# Altium project IMUVr3.PrjPcb
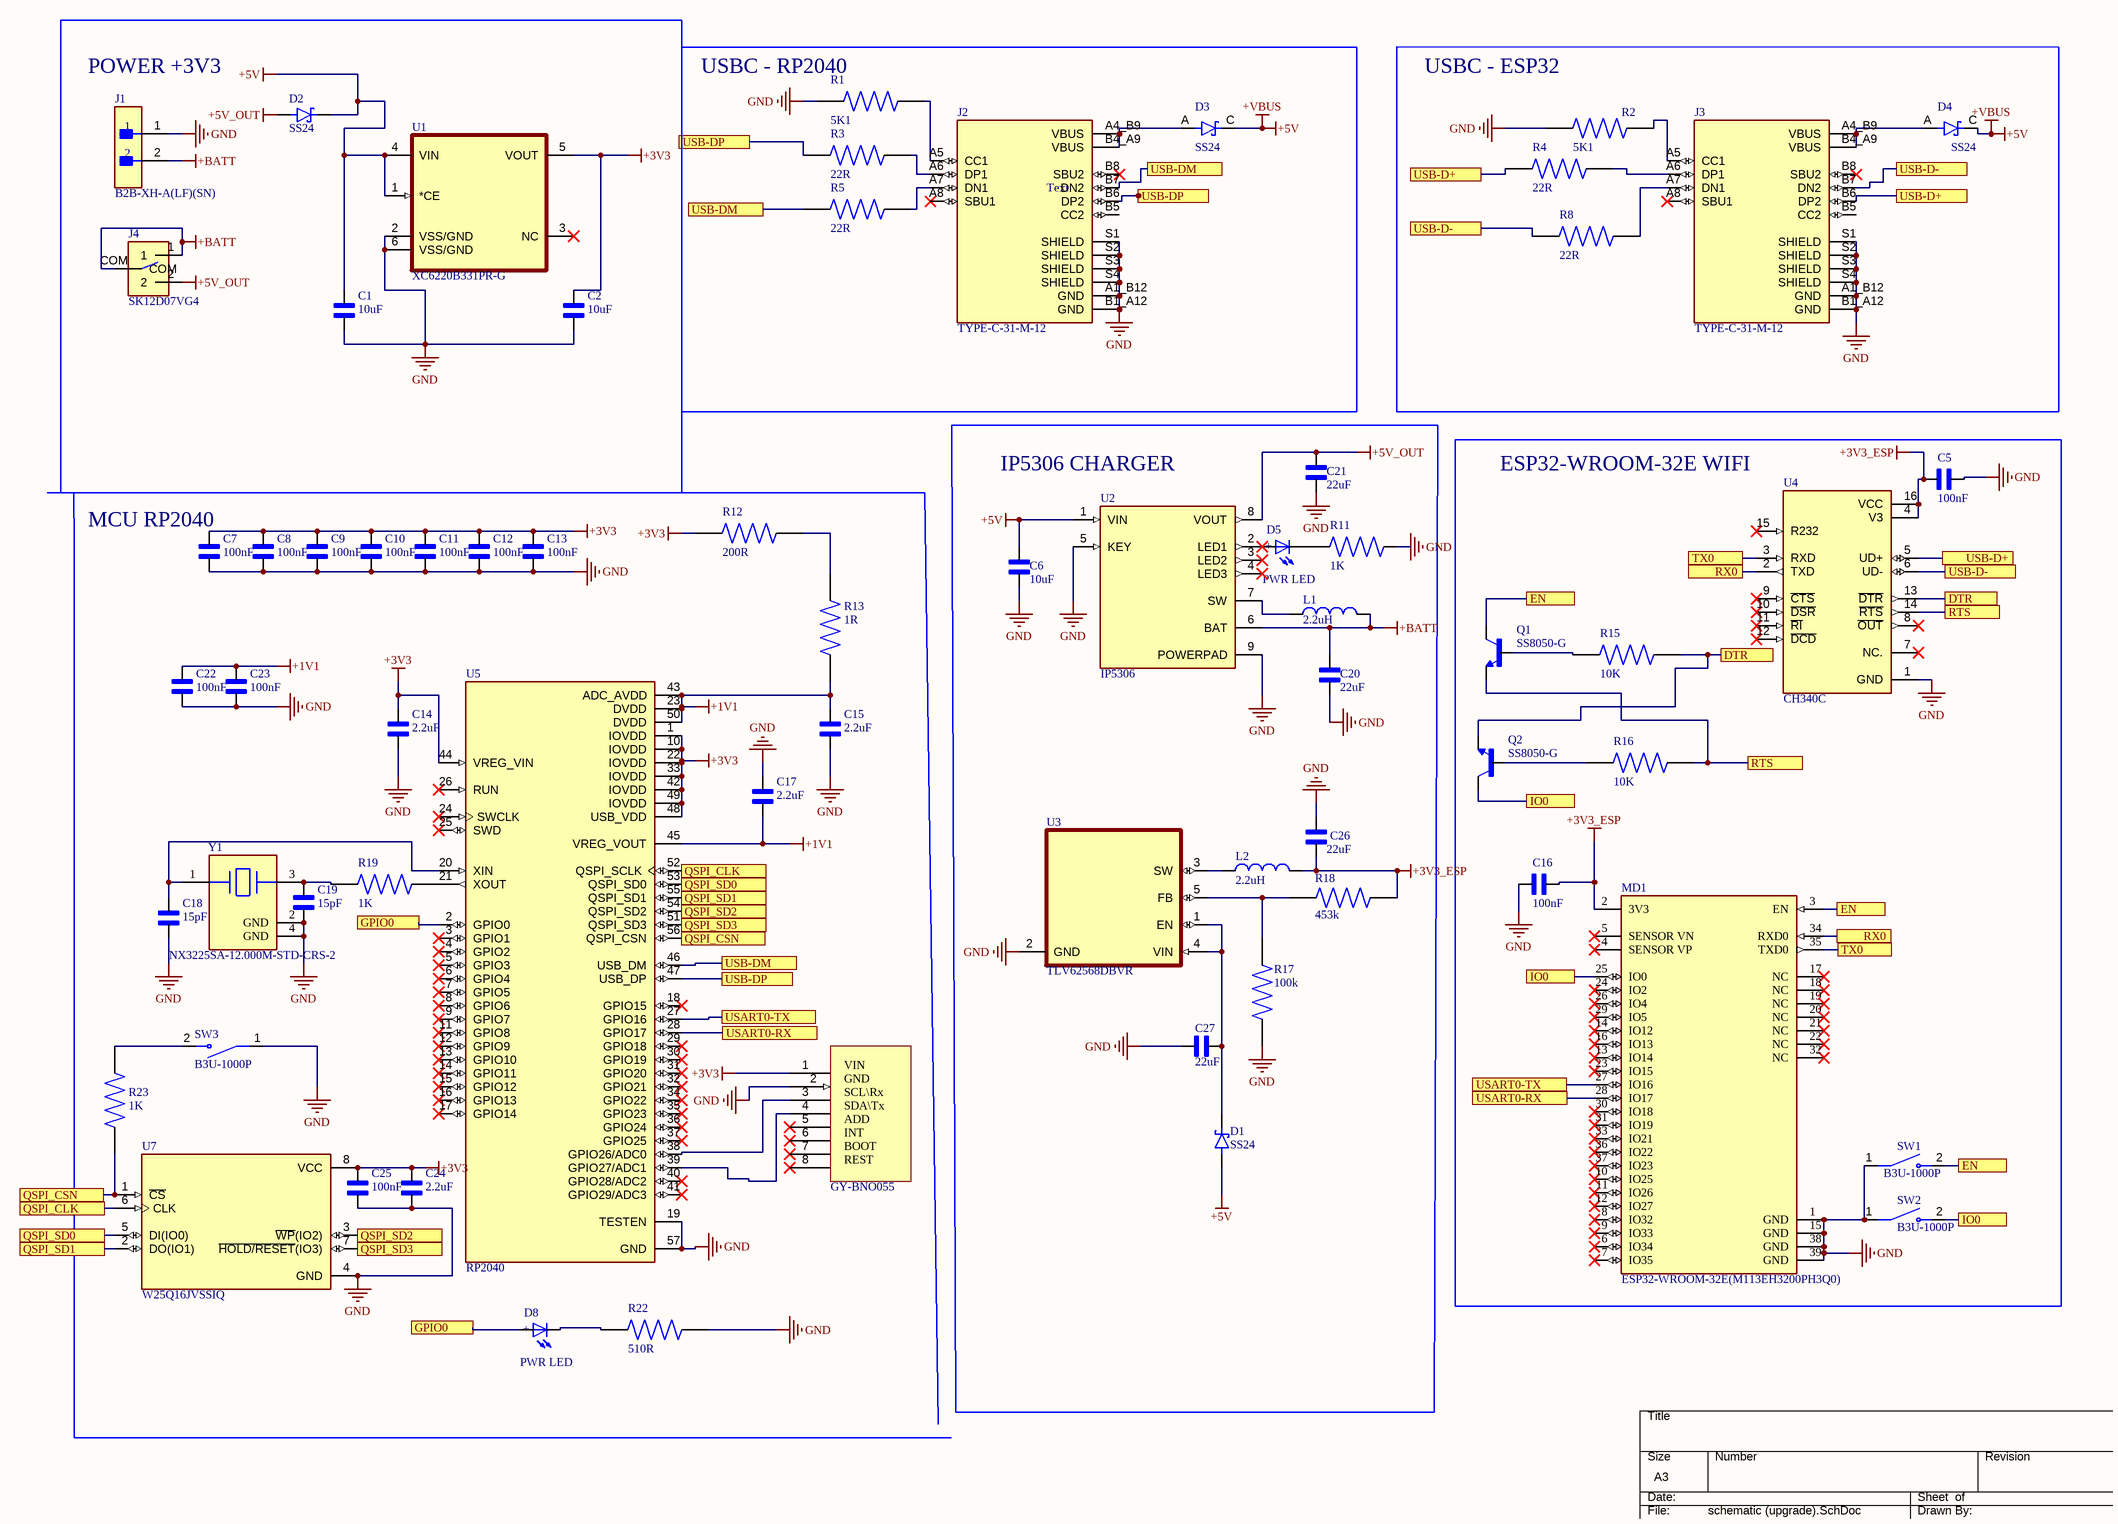
[diagram p0: schematic (upgrade).SchDoc]
1 sheet, 67 parts. Net scope: flat (ports and power ports of the same name join across sheets).
Board file: imuver3.PcbDoc

## Sheet schematic (upgrade).SchDoc: IMU Main Board
size A3; Author: Quang Dac Vinh CHU; DocumentNumber: Prj0501; Revision: 01; SheetNumber: 1; SheetTotal: 1

### Parts
C1  10uF  [CAPC1608X90N]
C2  10uF  [CAPC1608X90N]
C5  100nF  [CAPC1608X90N]
C6  10uF  [CAPC3216X190N]
C7  100nF  [CAPC1608X90N]
C8  100nF  [CAPC1608X90N]
C9  100nF  [CAPC1608X90N]
C10  100nF  [CAPC1608X90N]
C11  100nF  [CAPC1608X90N]
C12  100nF  [CAPC1608X90N]
C13  100nF  [CAPC1608X90N]
C14  2.2uF  [CAPC1608X90N]
C15  2.2uF  [CAPC1608X90N]
C16  100nF  [CAPC1608X90N]
C17  2.2uF  [CAPC1608X90N]
C18  15pF  [CAPC1608X90N]
C19  15pF  [CAPC1608X90N]
C20  22uF  [CAPC3216X190N]
C21  22uF  [CAPC3216X190N]
C22  100nF  [CAPC1608X90N]
C23  100nF  [CAPC1608X90N]
C24  2.2uF  [CAPC1608X90N]
C25  100nF  [CAPC1608X90N]
C26  22uF  [CAPC3216X190N]
C27  22uF  [CAPC3216X190N]
D1  SS24  [DIOM5336X265N]
D2  SS24  [DIOM5336X265N]
D3  SS24  [DIOM5336X265N]
D4  SS24  [DIOM5336X265N]
D5  PWR LED  [WL-SMCW_1206]
D8  PWR LED  [WL-SMCW_1206]
GY-BNO055  GY-BNO055  (value not drawn)
J1  B2B-XH-A(LF)(SN)  [FP-B2B-XH-A_LF_SN-MFG]
J2  TYPE-C-31-M-12  [HRO_TYPE-C-31-M-12]
J3  TYPE-C-31-M-12  [HRO_TYPE-C-31-M-12]
J4  SK12D07VG4  [SK12D07VG4]
L1  2.2uH  [INDC2012X55N]
L2  2.2uH  [INDC2012X55N]
MD1  ESP32-WROOM-32E(M113EH3200PH3Q0)  [FP-ESP32-WROOM-32E_M113EH-MFG]
Q1  SS8050-G  [TRANS_SS8050-G]
Q2  SS8050-G  [TRANS_SS8050-G]
R1  5K1  [RES_ERJU03J5R6V]
R2  5K1  [RES_ERJU03J5R6V]
R3  22R  [RES_ERJU03J5R6V]
R4  22R  [RES_ERJU03J5R6V]
R5  22R  [RES_ERJU03J5R6V]
R8  22R  [RES_ERJU03J5R6V]
R11  1K  [RES_ERJU03J5R6V]
R12  200R  [RES_ERJU03J5R6V]
R13  1R  [RES_ERJU03J5R6V]
R15  10K  [RES_ERJU03J5R6V]
R16  10K  [RES_ERJU03J5R6V]
R17  100k  [RES_ERJU03J5R6V]
R18  453k  [RES_ERJU03J5R6V]
R19  1K  [RES_ERJU03J5R6V]
R22  510R  [RES_ERJU03J5R6V]
R23  1K  [RES_ERJU03J5R6V]
SW1  B3U-1000P  [SW_B3U-1000P]
SW2  B3U-1000P  [SW_B3U-1000P]
SW3  B3U-1000P  [SW_B3U-1000P]
U1  XC6220B331PR-G  [SOT-89-5]
U2  IP5306  [SOP127P600X165-9N]
U3  TLV62568DBVR  [SOT95P280X145-5N]
U4  CH340C  [SOIC127P600X180-16N]
U5  RP2040  [QFN40P700X700X90-57N]
U7  W25Q16JVSSIQ  [SOIC127P790X216-8N]
Y1  NX3225SA-12.000M-STD-CRS-2  [FP-NX3225SA-MFG]

### Blocks framed on the sheet
USBC - RP2040: D3 J2 R1 R3 R5
USBC - ESP32: D4 J3 R2 R4 R8
IP5306 CHARGER: C6 C20 C21 C26 C27 D1 D5 L1 L2 R11 R17 R18 U2 U3
ESP32-WROOM-32E WIFI: C5 C16 MD1 Q1 Q2 R15 R16 SW1 SW2 U4

### Ports
DTR (see schematic (upgrade)[1C]), DTR (see schematic (upgrade)[2C]), EN (see schematic (upgrade)[1A], schematic (upgrade)[2B]), EN (see schematic (upgrade)[1A], schematic (upgrade)[3C]), EN (see schematic (upgrade)[2B], schematic (upgrade)[3C]), GPIO0 (see schematic (upgrade)[7A]), GPIO0 (see schematic (upgrade)[7B]), IO0 (see schematic (upgrade)[1A], schematic (upgrade)[3B]), IO0 (see schematic (upgrade)[3B]), QSPI_CLK (see schematic (upgrade)[6B]), QSPI_CLK (see schematic (upgrade)[8A]), QSPI_CSN (see schematic (upgrade)[6B]), QSPI_CSN (see schematic (upgrade)[8A]), QSPI_SD0 (see schematic (upgrade)[6B]), QSPI_SD0 (see schematic (upgrade)[8A]), QSPI_SD1 (see schematic (upgrade)[6B]), QSPI_SD1 (see schematic (upgrade)[8A]), QSPI_SD2 (see schematic (upgrade)[6B]), QSPI_SD2 (see schematic (upgrade)[7A]), QSPI_SD3 (see schematic (upgrade)[6B]), QSPI_SD3 (see schematic (upgrade)[7A]), RTS (see schematic (upgrade)[1C]), RTS (see schematic (upgrade)[2C]), RX0 (see schematic (upgrade)[2B]), RX0 (see schematic (upgrade)[2C]), TX0 (see schematic (upgrade)[2B]), TX0 (see schematic (upgrade)[2C]), USART0-RX (see schematic (upgrade)[3B]), USART0-RX (see schematic (upgrade)[6B]), USART0-TX (see schematic (upgrade)[3B]), USART0-TX (see schematic (upgrade)[6B]), USB-D+ (see schematic (upgrade)[1C], schematic (upgrade)[1D]), USB-D+ (see schematic (upgrade)[1C], schematic (upgrade)[3D]), USB-D+ (see schematic (upgrade)[1D], schematic (upgrade)[3D]), USB-D- (see schematic (upgrade)[1C], schematic (upgrade)[1D]), USB-D- (see schematic (upgrade)[1C], schematic (upgrade)[3D]), USB-D- (see schematic (upgrade)[1D], schematic (upgrade)[3D]), USB-DM (see schematic (upgrade)[4D], schematic (upgrade)[6B]), USB-DM (see schematic (upgrade)[4D], schematic (upgrade)[6D]), USB-DM (see schematic (upgrade)[6B], schematic (upgrade)[6D]), USB-DP (see schematic (upgrade)[4D], schematic (upgrade)[6B]), USB-DP (see schematic (upgrade)[4D], schematic (upgrade)[6D]), USB-DP (see schematic (upgrade)[6B], schematic (upgrade)[6D])

### Nets
+1V1: C15.2 C17.1 C22.1 C23.1 R13.2 U5.23(DVDD) U5.43(ADC_AVDD) U5.45(VREG_VOUT) U5.50(DVDD)
+3V3: C2.2 C7.1 C8.1 C9.1 C10.1 C11.1 C12.1 C13.1 C14.2 C24.2 C25.1 R12.1 U1.5(VOUT) U5.1(IOVDD) U5.10(IOVDD) U5.22(IOVDD) U5.33(IOVDD) U5.42(IOVDD) U5.44(VREG_VIN) U5.48(USB_VDD) U5.49(IOVDD) U7.8(VCC)
+3V3_ESP: C5.1 C16.2 C26.1 L2.2 MD1.2(3V3) R18.2 U4.4(V3) U4.16(VCC)
+5V: C1.2 C6.2 D1.A D2.C(K) D3.C(K) D4.C(K) U1.1(*CE) U1.4(VIN) U2.1(VIN)  [also labelled +VBUS]
+5V_OUT: C21.2 D2.A J4.2 U2.8(VOUT)
+BATT: C20.2 J1.2 J4.1 J4.COM L1.2 U2.6(BAT)
GND: C1.1 C2.1 C5.2 C6.1 C7.2 C8.2 C9.2 C10.2 C11.2 C12.2 C13.2 C14.1 C15.1 C16.1 C17.2 C18.2 C19.2 C20.1 C21.1 C22.2 C23.2 C24.1 C25.2 C26.2 C27.1 GY-BNO055.2 J1.1 J2.A1_B12(GND) J2.B1_A12(GND) J2.S1(SHIELD) J2.S2(SHIELD) J2.S3(SHIELD) J2.S4(SHIELD) J3.A1_B12(GND) J3.B1_A12(GND) J3.S1(SHIELD) J3.S2(SHIELD) J3.S3(SHIELD) J3.S4(SHIELD) MD1.1(GND) MD1.15(GND) MD1.38(GND) MD1.39(GND) R1.1 R2.1 R11.2 R17.1 R22.2 SW1.1 SW2.1 SW3.1 U1.2(VSS/GND) U1.6(VSS/GND) U2.5(KEY) U2.9(POWERPAD) U3.2(GND) U4.1(GND) U5.19(TESTEN) U5.57(GND) U7.4(GND) Y1.2(GND) Y1.4(GND)
NetC18_1: C18.1 U5.20(XIN) Y1.1
NetC19_1: C19.1 R19.2 Y1.3
NetC27_2: C27.2 D1.C(K) U3.1(EN) U3.4(VIN)
NetD3_A: D3.A J2.A4_B9(VBUS) J2.B4_A9(VBUS)
NetD4_A: D4.A J3.A4_B9(VBUS) J3.B4_A9(VBUS)
NetD5_1: D5.1(NEG) R11.1
NetD5_2: D5.2(POS) U2.2(LED1)
NetD8_1: D8.1(NEG) R22.1
NetD8_2: D8.2(POS) U5.2(GPIO0) ; port GPIO0
NetJ2_A5: J2.A5(CC1) R1.2
NetJ2_A6: J2.A6(DP1) R3.2
NetJ2_A7: J2.A7(DN1) R5.2
NetJ2_B6: J2.B6(DP2) R3.1 U5.47(USB_DP) ; port USB-DP
NetJ2_B7: J2.B7(DN2) R5.1 U5.46(USB_DM) ; port USB-DM
NetJ3_A5: J3.A5(CC1) R2.2
NetJ3_A6: J3.A6(DP1) R4.2
NetJ3_A7: J3.A7(DN1) R8.2
NetJ3_B6: J3.B6(DP2) R4.1 U4.5(UD+) ; port USB-D+
NetJ3_B7: J3.B7(DN2) R8.1 U4.6(UD-) ; port USB-D-
NetL1_1: L1.1 U2.7(SW)
NetL2_1: L2.1 U3.3(SW)
NetMD1_3: MD1.3(EN) Q1.3(C) SW1.2 ; port EN
NetMD1_25: MD1.25(IO0) Q2.3(C) SW2.2 ; port IO0
NetMD1_27: MD1.27(IO16) U5.27(GPIO16) ; port USART0-TX
NetMD1_28: MD1.28(IO17) U5.28(GPIO17) ; port USART0-RX
NetMD1_34: MD1.34(RXD0) U4.2(TXD) ; port RX0
NetMD1_35: MD1.35(TXD0) U4.3(RXD) ; port TX0
NetQ1_1: Q1.1(B) R15.2
NetQ1_2: Q1.2(E) R16.1 U4.14(~{RTS}) ; port RTS
NetQ2_1: Q2.1(B) R16.2
NetQ2_2: Q2.2(E) R15.1 U4.13(~{DTR}) ; port DTR
NetR12_2: R12.2 R13.1
NetR17_2: R17.2 R18.1 U3.5(FB)
NetR19_1: R19.1 U5.21(XOUT)
NetR23_1: R23.1 SW3.2
NetR23_2: R23.2 U5.56(QSPI_CSN) U7.1(~{CS}) ; port QSPI_CSN
NetU5_51: U5.51(QSPI_SD3) U7.7(~{HOLD/RESET}(IO3)) ; port QSPI_SD3
NetU5_52: U5.52(QSPI_SCLK) U7.6(CLK) ; port QSPI_CLK
NetU5_53: U5.53(QSPI_SD0) U7.5(DI(IO0)) ; port QSPI_SD0
NetU5_54: U5.54(QSPI_SD2) U7.3(~{WP}(IO2)) ; port QSPI_SD2
NetU5_55: U5.55(QSPI_SD1) U7.2(DO(IO1)) ; port QSPI_SD1

Not connected (* = marked no-connect by the designer): GY-BNO055 1(49) 3(51) 4(52) 5(53) 6(54) 7(55) 8(56); J2 A8(SBU1)* B5(CC2) B8(SBU2)*; J3 A8(SBU1)* B5(CC2) B8(SBU2)*; MD1 4(SENSOR_VP)* 5(SENSOR_VN)* 6(IO34)* 7(IO35)* 8(IO32)* 9(IO33)* 10(IO25)* 11(IO26)* 12(IO27)* 13(IO14)* 14(IO12)* 16(IO13)* 17(NC)* 18(NC)* 19(NC)* 20(NC)* 21(NC)* 22(NC)* 23(IO15)* 24(IO2)* 26(IO4)* 29(IO5)* 30(IO18)* 31(IO19)* 32(NC)* 33(IO21)* 36(IO22)* 37(IO23)*; U1 3(NC)*; U2 3(LED2)* 4(LED3)*; U4 7(NC.)* 8(~{OUT})* 9(~{CTS})* 10(~{DSR})* 11(~{RI})* 12(~{DCD})* 15(R232)*; U5 3(GPIO1)* 4(GPIO2)* 5(GPIO3)* 6(GPIO4)* 7(GPIO5)* 8(GPIO6)* 9(GPIO7)* 11(GPIO8)* 12(GPIO9)* 13(GPIO10)* 14(GPIO11)* 15(GPIO12)* 16(GPIO13)* 17(GPIO14)* 18(GPIO15)* 24(SWCLK)* 25(SWD)* 26(RUN)* 29(GPIO18)* 30(GPIO19)* 31(GPIO20)* 32(GPIO21)* 34(GPIO22)* 35(GPIO23)* 36(GPIO24)* 37(GPIO25)* 38(GPIO26/ADC0) 39(GPIO27/ADC1) 40(GPIO28/ADC2)* 41(GPIO29/ADC3)*

### Notes on the sheet
- POWER +3V3
- (near J2) Text
- (near C7) MCU RP2040
- THIS DOCUMENT AND THE DATA DISCLOSED HEREIN OR
- HEREWITH IS THE PROPERTY OF ALTIUM LIMITED AND MAY
- DWG NO:
- REVISION
- REV:
- DESCRIPTION
- DATE
- APPROVED
- BE FREELY DISTRIBUTED IN WHOLE. NO RIGHTS ARE
- RESERVED OR EXPRESS OR IMPLIED WARANTEE GIVEN.
- ENG:
- APPROVALS
- PROJECT
- DSN:
- CHK:
- REFERENCE DOCUMENTS
- PROJECT REVISION:
- TITLE
- DOCUMENT REVISION:
- DESIGN ITEM:
- BOM:
- FAB DWG:
- PCB DWG:
- ASSY DWG:
- SCALE:
- A3
- SIZE
- CAGE CODE
- FILE NAME
- DWG NO.
- SHEET
- OF
- REV
- (in symbol GY-BNO055) VIN; GND; SCL\Rx; SDA\Tx; ADD; INT; BOOT; REST
- (in symbol WL-SMCW_1206) +

### Library data of the parts
C1 C2 C5 C7-C19 C22-C25 = C0603C104K4RAC: 0.1 ÂµF Â±10% 16V Ceramic Capacitor X7R 0603 (1608 Metric); MF: KEMET; SnapEDA_Link: https://www.snapeda.com/parts/C0603C104K4RAC/KEMET/view-part/?ref=snap; Package: 603-2 KEMET; Value: *; MP: C0603C104K4RAC; Check_prices: https://www.snapeda.com/parts/C0603C104K4RAC/KEMET/view-part/?ref=eda
C6 C20 C21 C26 C27 = CGA5L1X8L0G226M160AC: 22 ÂµF Â±20% 4V Ceramic Capacitor X8L 1206 (3216 Metric); MF: TDK; SnapEDA_Link: https://www.snapeda.com/parts/CGA5L1X8L0G226M160AC/TDK/view-part/?ref=snap; Package: 3216 TDK; Value: *; MP: CGA5L1X8L0G226M160AC; Check_prices: https://www.snapeda.com/parts/CGA5L1X8L0G226M160AC/TDK/view-part/?ref=eda
D1-D4 = SS24: Diode Schottky 40V 2A Surface Mount DO-214AA (SMB); MF: ON Semiconductor; Package: DO-214AA ON Semiconductor; Price: None; Value: *; SnapEDA_Link: https://www.snapeda.com/parts/SS24/Onsemi/view-part/?ref=snap; MP: SS24; Availability: In Stock; Check_prices: https://www.snapeda.com/parts/SS24/Onsemi/view-part/?ref=eda
D5 D8 = WL-SMCW_1206: 1206, Super Red Typ.(@20mA): 630nm, 60mcd, 1.9V, 140Â° AlInGaP; MF: Wurth Electronics; MP: 150120SS75000; SnapEDA_Link: https://www.snapeda.com/parts/150120SS75000/Wurth+Electronics/view-part/?ref=snap; Package: 1206 Wurth Electronics; Value: *; Check_prices: https://www.snapeda.com/parts/150120SS75000/Wurth+Electronics/view-part/?ref=eda
J1 = CMP-2000-05888-3: CONN HEADER VERT 2POS 2.5MM; Current Rating: 3A; Voltage Rating: 250V; Number of Contacts: 2; Contact Resistance: 20mR; Wire/Cable Gauge: 22AWG; Insulation Resistance: 1GR; Connector Type: Male Pin; Packaging: Bulk; Contact Material: Brass; Lead Free: Lead Free; Orientation: Straight; Contact Plating: Tin; Max Current Rating: 3A; Termination: Solder; Fastening Type: Detent; Depth: 5.75mm; Housing Material: Polyamide; REACH SVHC: No SVHC; Series: XH; Voltage Rating (AC): 250V; Number of Positions: 2; Color: Natural; Contact Type: Male Pin; Max Voltage Rating (DC): 250V; Pitch: 2.5mm; Lead Pitch: 2.5mm; Mount: Through Hole; Max Operating Temperature: 85°C; Length: 7.4mm; Max Voltage Rating (AC): 250V; Min Operating Temperature: -25°C; Number of Rows: 1; Housing Color: White
J2 J3 = TYPE-C-31-M-12: USB Connectors 24 Receptacle 1 8.94*7.3mm RoHS; MF: HRO Electronics Co., Ltd.; SnapEDA_Link: https://www.snapeda.com/parts/TYPE-C-31-M-12/HRO+Electronics+Co.%252C+Ltd./view-part/?ref=snap; Package: Package; Value: *; MP: TYPE-C-31-M-12; Check_prices: https://www.snapeda.com/parts/TYPE-C-31-M-12/HRO+Electronics+Co.%252C+Ltd./view-part/?ref=eda
J4 = SK12D07VG4: Switch Slide ON ON SPDT Side Slide 0.3A 30VDC PC Pins Bracket Mount/Through Hole Bulk; MF: C&K; SnapEDA_Link: https://www.snapeda.com/parts/SK12D07VG4/C%2526K/view-part/?ref=snap; Package: None; Value: *; MP: SK12D07VG4; Check_prices: https://www.snapeda.com/parts/SK12D07VG4/C%2526K/view-part/?ref=eda
L1 L2 = LQM21PN2R2MCHD: Inductor with Inductance: 2.2uH Tol. +/-20%, Package: 0805 _2012_; MF: Murata; Digi-Key_Part_Number: 490-15992-1-ND; Package: 2012 Bourns; Value: *; SnapEDA_Link: https://www.snapeda.com/parts/LQM21PN2R2MCHD/Murata%20Electronics%20North%20America/view-part/1498675/?ref=snap; Digi-Key_Purchase_URL: https://www.digikey.com/product-detail/en/murata-electronics/LQM21PN2R2MCHD/490-15992-1-ND/6800657?utm_source=snapeda&utm_medium=aggregator&utm_campaign=symbol; MP: LQM21PN2R2MCHD
MD1 = CMP-194065-000012-1: RX TXRX MOD WIFI TRACE ANT SMD
Q1 Q2 = SS8050-G: Bipolar (BJT) Transistor NPN 25 V 1.5 A 100MHz 300 mW Surface Mount SOT-23-3; MP: SS8050G; MF: Comchip; Digi-Key_Part_Number: 641-1790-2-ND; Check_prices: https://www.snapeda.com/parts/SS8050G/Comchip/view-part/?ref=eda; Package: None; SnapEDA_Link: https://www.snapeda.com/parts/SS8050G/Comchip/view-part/?ref=snap; Value: *
R1-R5 R8 R11-R13 R15-R19 R22 R23 = ERJU03J5R6V: 0201 anti-sulfurated resistor 0603 Anti-Sulfurated; MF: Panasonic; MP: ERJ-U03J5R6V; SnapEDA_Link: https://www.snapeda.com/parts/ERJ-U03J5R6V/Panasonic/view-part/?ref=snap; Package: 1608-2 Panasonic; Value: *; Check_prices: https://www.snapeda.com/parts/ERJ-U03J5R6V/Panasonic/view-part/?ref=eda
SW1-SW3 = B3U-1000P: Switch Tactile N.O. SPST Round Button Gull Wing 0.05A 12VDC 1.5N SMD Embossed T/R; Price: None; MP: B3U-1000P; Availability: Unavailable; Value: *; Package: None
U1 = XC6220B331PR-G: Linear Voltage Regulator IC Positive Fixed 1 Output 1A SOT-89-5; MF: Torex; SnapEDA_Link: https://www.snapeda.com/parts/XC6220B331PR-G/Torex/view-part/?ref=snap; Package: SOT-89 Torex; Value: *; MP: XC6220B331PR-G; Check_prices: https://www.snapeda.com/parts/XC6220B331PR-G/Torex/view-part/?ref=eda
U2 = IP5306: Fully-Integrated Power Bank System-On-Chip with 2.1A charger, 2.4A discharger; MF: Injoinic; SnapEDA_Link: https://www.snapeda.com/parts/IP5306/Injoinic/view-part/?ref=snap; Package: SOIC-4 INJOINIC; Value: *; MP: IP5306; Check_prices: https://www.snapeda.com/parts/IP5306/Injoinic/view-part/?ref=eda
U3 = TLV62568DBVR: 2.5V-5.5V input, 1A high efficiency step-down buck converter in SOT23 and SOT563 package; MF: Texas Instruments; SnapEDA_Link: https://www.snapeda.com/parts/TLV62568DBVR/Texas+Instruments/view-part/?ref=snap; Package: SOT-23-5 Texas Instruments; Value: *; MP: TLV62568DBVR; Check_prices: https://www.snapeda.com/parts/TLV62568DBVR/Texas+Instruments/view-part/?ref=eda
U4 = CH340C: USB to serial chip CH340; MF: WCH; Price: None; Availability: Not in stock; MP: CH340C; Package: None; SnapEDA_Link: https://www.snapeda.com/parts/CH340C/WCH/view-part/?ref=snap; Check_prices: https://www.snapeda.com/parts/CH340C/WCH/view-part/?ref=eda; Value: *
U5 = RP2040: RP2040 chip for Raspberry Pi Pico - ARM® Cortex®-M0+ MCU 32-Bit; SnapEDA_Link: https://www.snapeda.com/parts/RP2040/Raspberry+Pi/view-part/?ref=snap; Package: None; Value: *; MF: Raspberry Pi; MP: RP2040; Check_prices: https://www.snapeda.com/parts/RP2040/Raspberry+Pi/view-part/?ref=eda
U7 = W25Q16JVSSIQ: MF: {'manufacturer': u'Winbond Electronics'}; Package: None; Price: None; Value: *; MP: W25Q16JVSSIQ; Availability: Unavailable
Y1 = CMP-200220-000016-1: Frequency Tolerance: 15ppm; Frequency: 12MHz; Frequency Stability: 50ppm; ESR (Equivalent Series Resistance): 120R; Load Capacitance: 8pF; Case/Package: SMD/SMT; RoHS Compliant: Yes; Mount: Surface Mount; Ratings: AEC-Q200; Length: 0.126inch; Packaging: Tape and Reel; Width: 0.098inch; Min Operating Temperature: -40°C; Height: 0.024inch; Max Operating Temperature: 125°C